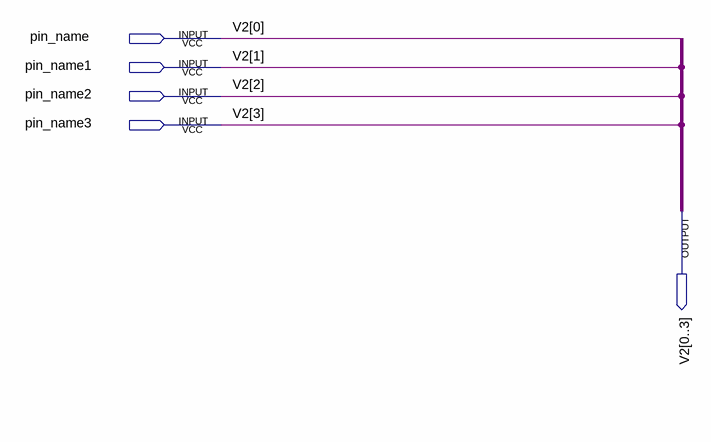
[diagram p0: schematic sheet]
// Quartus schematic gambi.bdf as structural Verilog: 0 symbols, 5 pins
module gambi (
  input  pin_name,
  input  pin_name1,
  input  pin_name2,
  input  pin_name3,
  output [0:3] V2
);


  assign V2 = {pin_name, pin_name1, pin_name2, pin_name3};
endmodule
